# Altium schematic sheet MUSB_05_X_B_SM_A.SchDoc
size A4
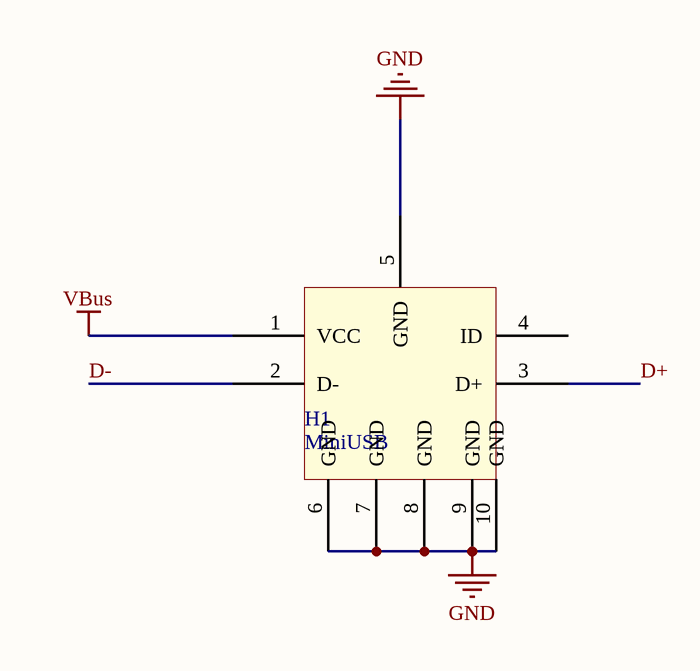
[diagram p0: MUSB_05_X_B_SM_A.SchDoc]

## Parts
H1  MiniUSB  [MiniUSB]

## Nets
GND: H1.5(GND) H1.6(GND) H1.7(GND) H1.8(GND) H1.9(GND) H1.10(GND)
VBus: H1.1(VCC)
D+: H1.3(D+)
D-: H1.2(D-)

Not connected (* = marked no-connect by the designer): H1 4(ID)